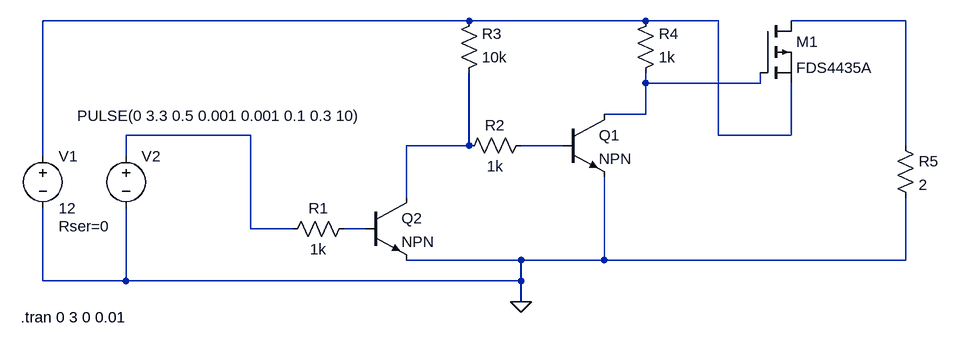
[diagram p0: schematic Mosfet Power Stage.asc]
Mosfet Power Stage.asc, the LTspice schematic file:
Version 4
SHEET 1 880 680
WIRE 32 -64 -624 -64
WIRE 304 -64 32 -64
WIRE 416 -64 304 -64
WIRE 704 -64 528 -64
WIRE 304 32 304 16
WIRE 480 32 480 16
WIRE 480 32 304 32
WIRE 304 80 304 32
WIRE 304 80 240 80
WIRE -304 112 -496 112
WIRE 416 112 416 -64
WIRE 528 112 528 32
WIRE 528 112 416 112
WIRE 32 128 32 16
WIRE 32 128 -64 128
WIRE 176 128 112 128
WIRE 704 128 704 -64
WIRE -624 144 -624 -64
WIRE -496 144 -496 112
WIRE -64 208 -64 128
WIRE -304 256 -304 112
WIRE -240 256 -304 256
WIRE -128 256 -160 256
WIRE 112 304 -64 304
WIRE 240 304 240 176
WIRE 240 304 112 304
WIRE 704 304 704 208
WIRE 704 304 240 304
WIRE -624 336 -624 224
WIRE -496 336 -496 224
WIRE -496 336 -624 336
WIRE 112 336 112 304
WIRE 112 336 -496 336
WIRE 112 368 112 336
FLAG 112 368 0
SYMBOL npn3 176 80 R0
SYMATTR InstName Q1
SYMBOL npn3 -128 208 R0
SYMATTR InstName Q2
SYMBOL pmos 480 -64 R0
SYMATTR InstName M1
SYMATTR Value FDS4435A
SYMBOL res -144 240 R90
WINDOW 0 0 56 VBottom 2
WINDOW 3 32 56 VTop 2
SYMATTR InstName R1
SYMATTR Value 1k
SYMBOL res 128 112 R90
WINDOW 0 0 56 VBottom 2
WINDOW 3 32 56 VTop 2
SYMATTR InstName R2
SYMATTR Value 1k
SYMBOL res 16 32 M180
WINDOW 0 36 76 Left 2
WINDOW 3 36 40 Left 2
SYMATTR InstName R3
SYMATTR Value 10k
SYMBOL res 288 32 M180
WINDOW 0 36 76 Left 2
WINDOW 3 36 40 Left 2
SYMATTR InstName R4
SYMATTR Value 1k
SYMBOL res 688 112 R0
SYMATTR InstName R5
SYMATTR Value 2
SYMBOL voltage -624 128 R0
WINDOW 123 0 0 Left 0
WINDOW 39 24 124 Left 2
SYMATTR InstName V1
SYMATTR Value 12
SYMATTR SpiceLine Rser=0
SYMBOL voltage -496 128 R0
WINDOW 3 -75 -46 Left 2
WINDOW 123 0 0 Left 0
WINDOW 39 0 0 Left 0
SYMATTR InstName V2
SYMATTR Value PULSE(0 3.3 0.5 0.001 0.001 0.1 0.3 10)
TEXT -658 392 Left 2 !.tran 0 3 0 0.01

The netlist it stands for:
* Mosfet Power Stage.asc
Q1 N003 N006 0 0 NPN
Q2 N005 N007 0 0 NPN
M1 N002 N003 N001 N001 FDS4435A
R1 N007 N004 1k
R2 N006 N005 1k
R3 N005 N001 10k
R4 N003 N001 1k
R5 N002 0 2
V1 N001 0 12 Rser=0
V2 N004 0 PULSE(0 3.3 0.5 0.001 0.001 0.1 0.3 10)
.model NPN NPN
.model PNP PNP
.lib standard.bjt
.model NMOS NMOS
.model PMOS PMOS
.lib standard.mos
.tran 0 3 0 0.01
.backanno
.end